# EAGLE schematic untitled_v2 (EAGLE 8.5.2)
ESP Devkit-C Shield
CNAME: Adafruit M0 Adalogger NB-IoT Shield Design; CREVISION: 1.0; DESIGNER: EREN MERT IREZ; UNTITLED: Shield Schematic
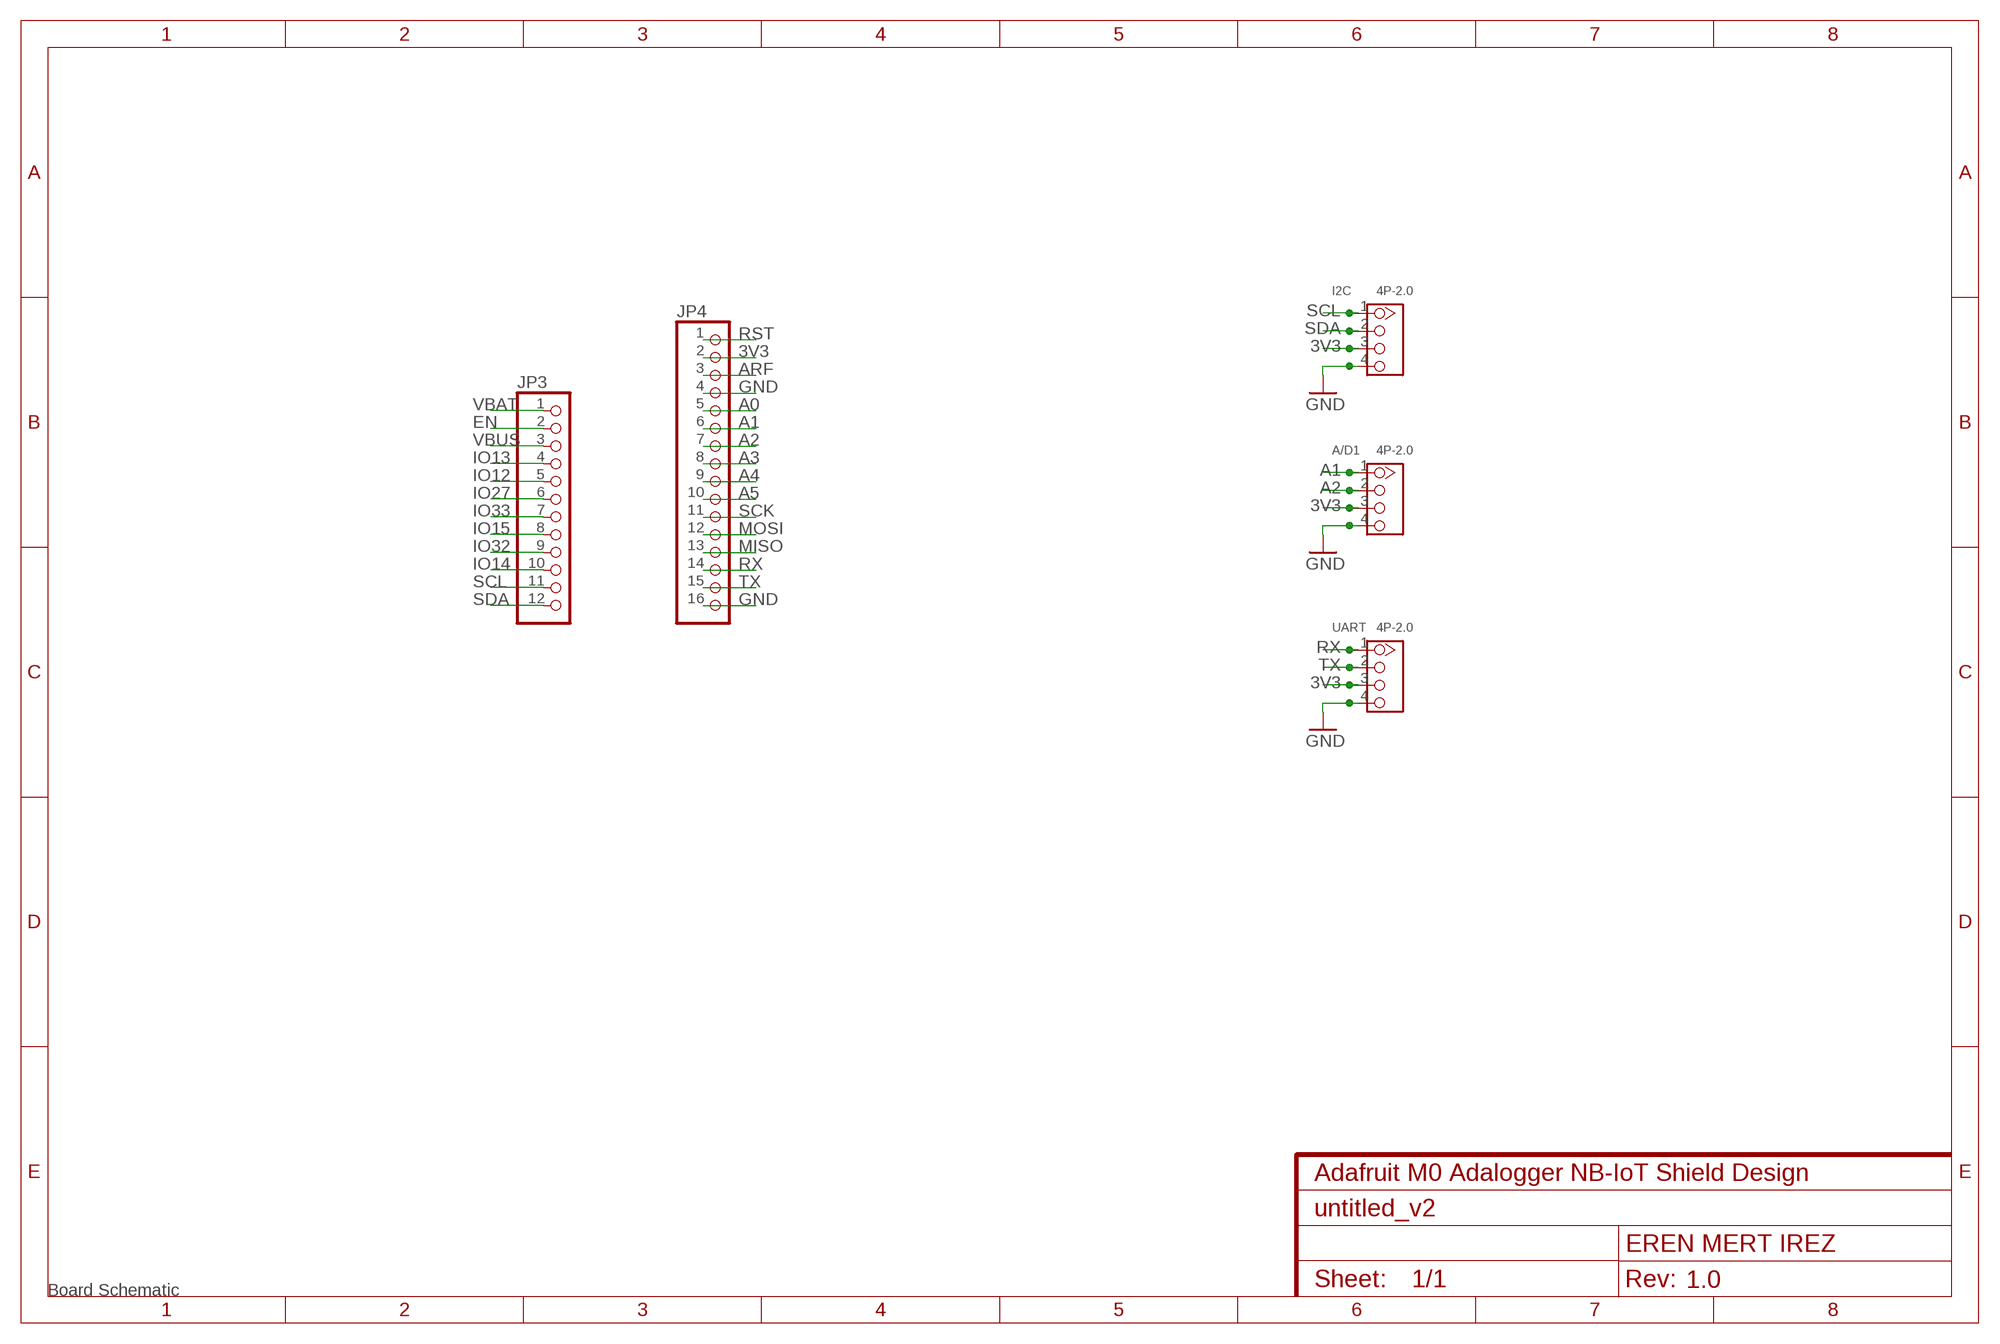
[diagram p0: schematic, sheet 1]
FRAME1 (FRAME-A4L): UNTITLED: Board Schematic

## Parts
A/D1  4P-2.0  GROVE-CONNECTOR-DIP(4P-2.0)  [HW4-2.0]
I2C  4P-2.0  GROVE-CONNECTOR-DIP(4P-2.0)  [HW4-2.0]
JP3  PINHD-1X12  [1X12]
JP4  PINHD-1X16  [1X16]
UART  4P-2.0  GROVE-CONNECTOR-DIP(4P-2.0)  [HW4-2.0]

## Nets
3V3: A/D1.3 I2C.3 JP4.2 UART.3
A0: JP4.5
A1: A/D1.1 JP4.6
A2: A/D1.2 JP4.7
A3: JP4.8
A4: JP4.9
A5: JP4.10
ARF: JP4.3
EN: JP3.2
GND: A/D1.4 I2C.4 JP4.4 JP4.16 UART.4
IO12: JP3.5
IO13: JP3.4
IO14: JP3.10
IO15: JP3.8
IO27: JP3.6
IO32: JP3.9
IO33: JP3.7
MISO: JP4.13
MOSI: JP4.12
RST: JP4.1
RX: JP4.14 UART.1
SCK: JP4.11
SCL: I2C.1 JP3.11
SDA: I2C.2 JP3.12
TX: JP4.15 UART.2
VBAT: JP3.1
VBUS: JP3.3

## Library data of the parts
A/D1 I2C UART = Seeed-Connector -2016:GROVE-CONNECTOR-DIP(4P-2.0): 320110033
JP3 = pinhead:PINHD-1X12: PIN HEADER
JP4 = pinhead:PINHD-1X16: PIN HEADER